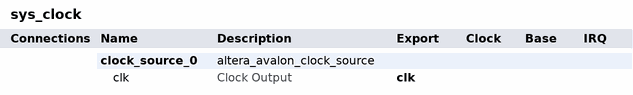
[diagram p0: system contents]
# Platform Designer (Qsys) system sys_clock, Cyclone V 5CSEMA5F31C6
# Parameters at their usual value, and those the tool derives, are not listed.
package require -exact qsys 18.1
create_system sys_clock
set_project_property DEVICE_FAMILY {Cyclone V}
set_project_property DEVICE 5CSEMA5F31C6

add_instance clock_source_0 altera_avalon_clock_source 18.1
set_instance_property clock_source_0 AUTO_EXPORT true
set_instance_parameter_value clock_source_0 CLOCK_RATE 50
set_instance_parameter_value clock_source_0 CLOCK_UNIT 1000000

# exported interfaces
add_interface clk clock source
set_interface_property clk EXPORT_OF clock_source_0.clk

set_interconnect_requirement {$system} qsys_mm.clockCrossingAdapter HANDSHAKE
set_interconnect_requirement {$system} qsys_mm.enableEccProtection FALSE
set_interconnect_requirement {$system} qsys_mm.insertDefaultSlave FALSE
set_interconnect_requirement {$system} qsys_mm.maxAdditionalLatency 1

save_system sys_clock.qsys
